# EAGLE design GE864 Breakout v12 (EAGLE 5.04)
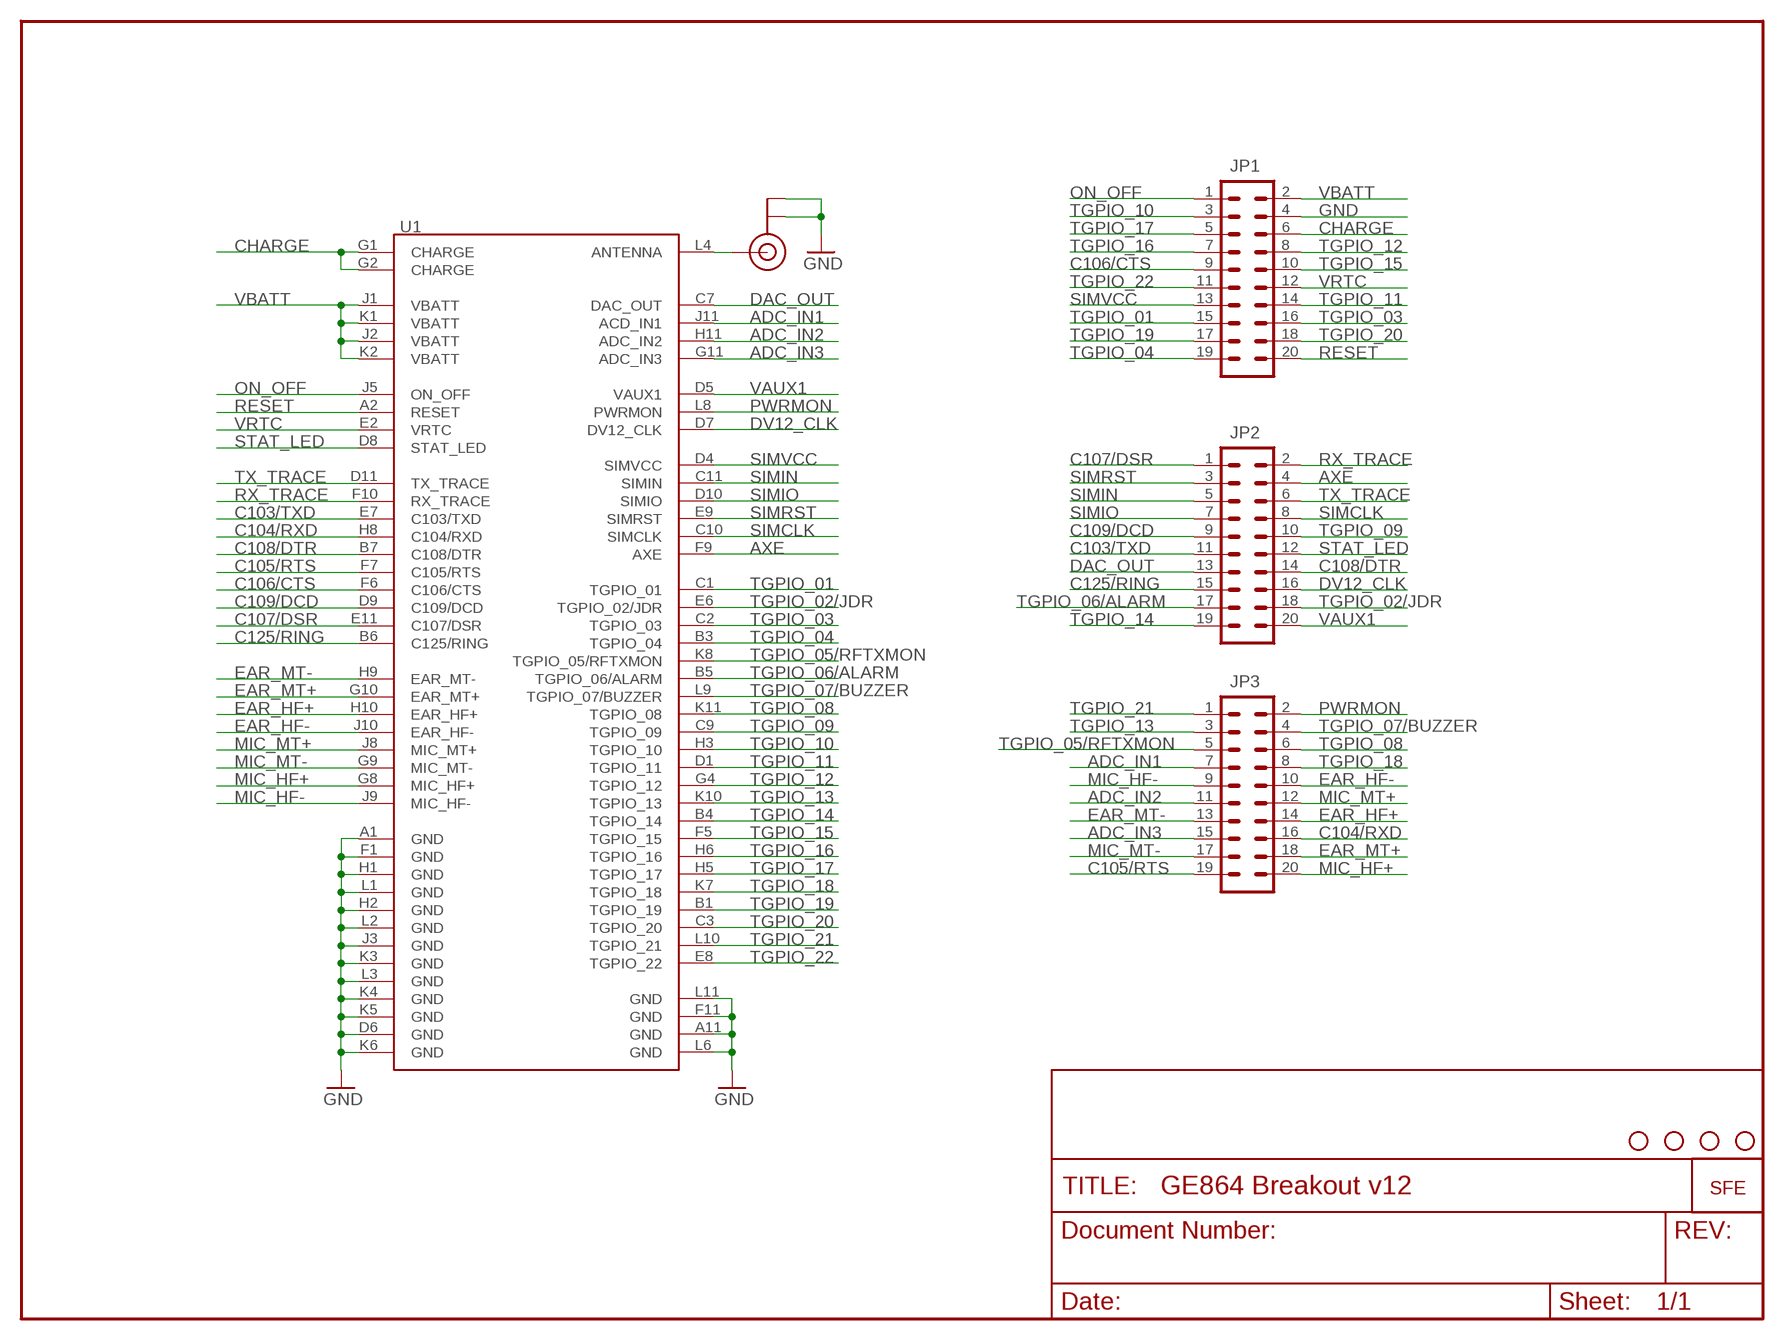
[diagram p0: schematic, sheet 1]

## Parts
JP1  M10X2NOSILK  [2X10_NOSILK]
JP2  M10X2NOSILK  [2X10_NOSILK]
JP3  M10X2NOSILK  [2X10_NOSILK]
U1  GE864  [GE864]
U$1  STAND-OFF  [STAND-OFF]
U$2  STAND-OFF  [STAND-OFF]
U$3  STAND-OFF  [STAND-OFF]
U$4  STAND-OFF  [STAND-OFF]
U$5  LOGO-SFENEW  [SFE-NEW-WEBLOGO]
U$6  U.FL  [U.FL]

## Nets
ADC_IN1: JP3.7 U1.J11(ACD_IN1)
ADC_IN2: JP3.11 U1.H11(ADC_IN2)
ADC_IN3: JP3.15 U1.G11(ADC_IN3)
AXE: JP2.4 U1.F9(AXE)
C103/TXD: JP2.11 U1.E7(C103/TXD)
C104/RXD: JP3.16 U1.H8(C104/RXD)
C105/RTS: JP3.19 U1.F7(C105/RTS)
C106/CTS: JP1.9 U1.F6(C106/CTS)
C107/DSR: JP2.1 U1.E11(C107/DSR)
C108/DTR: JP2.14 U1.B7(C108/DTR)
C109/DCD: JP2.9 U1.D9(C109/DCD)
C125/RING: JP2.15 U1.B6(C125/RING)
CHARGE: JP1.6 U1.G1(CHARGE) U1.G2(CHARGE)
DAC_OUT: JP2.13 U1.C7(DAC_OUT)
DV12_CLK: JP2.16 U1.D7(DV12_CLK)
EAR_HF+: JP3.14 U1.H10(EAR_HF+)
EAR_HF-: JP3.10 U1.J10(EAR_HF-)
EAR_MT+: JP3.18 U1.G10(EAR_MT+)
EAR_MT-: JP3.13 U1.H9(EAR_MT-)
GND: JP1.4 U1.A1(GND) U1.A11(GND) U1.D6(GND) U1.F1(GND) U1.F11(GND) U1.H1(GND) U1.H2(GND) U1.J3(GND) U1.K3(GND) U1.K4(GND) U1.K5(GND) U1.K6(GND) U1.L1(GND) U1.L2(GND) U1.L3(GND) U1.L6(GND) U1.L11(GND) U$6.P$1(GND) U$6.P$2(GND)
MIC_HF+: JP3.20 U1.G8(MIC_HF+)
MIC_HF-: JP3.9 U1.J9(MIC_HF-)
MIC_MT+: JP3.12 U1.J8(MIC_MT+)
MIC_MT-: JP3.17 U1.G9(MIC_MT-)
N$1: U1.L4(ANTENNA) U$6.P$3(SIGNAL)
ON_OFF: JP1.1 U1.J5(ON_OFF)
PWRMON: JP3.2 U1.L8(PWRMON)
RESET: JP1.20 U1.A2(RESET)
RX_TRACE: JP2.2 U1.F10(RX_TRACE)
SIMCLK: JP2.8 U1.C10(SIMCLK)
SIMIN: JP2.5 U1.C11(SIMIN)
SIMIO: JP2.7 U1.D10(SIMIO)
SIMRST: JP2.3 U1.E9(SIMRST)
SIMVCC: JP1.13 U1.D4(SIMVCC)
STAT_LED: JP2.12 U1.D8(STAT_LED)
TGPIO_01: JP1.15 U1.C1(TGPIO_01)
TGPIO_02/JDR: JP2.18 U1.E6(TGPIO_02/JDR)
TGPIO_03: JP1.16 U1.C2(TGPIO_03)
TGPIO_04: JP1.19 U1.B3(TGPIO_04)
TGPIO_05/RFTXMON: JP3.5 U1.K8(TGPIO_05/RFTXMON)
TGPIO_06/ALARM: JP2.17 U1.B5(TGPIO_06/ALARM)
TGPIO_07/BUZZER: JP3.4 U1.L9(TGPIO_07/BUZZER)
TGPIO_08: JP3.6 U1.K11(TGPIO_08)
TGPIO_09: JP2.10 U1.C9(TGPIO_09)
TGPIO_10: JP1.3 U1.H3(TGPIO_10)
TGPIO_11: JP1.14 U1.D1(TGPIO_11)
TGPIO_12: JP1.8 U1.G4(TGPIO_12)
TGPIO_13: JP3.3 U1.K10(TGPIO_13)
TGPIO_14: JP2.19 U1.B4(TGPIO_14)
TGPIO_15: JP1.10 U1.F5(TGPIO_15)
TGPIO_16: JP1.7 U1.H6(TGPIO_16)
TGPIO_17: JP1.5 U1.H5(TGPIO_17)
TGPIO_18: JP3.8 U1.K7(TGPIO_18)
TGPIO_19: JP1.17 U1.B1(TGPIO_19)
TGPIO_20: JP1.18 U1.C3(TGPIO_20)
TGPIO_21: JP3.1 U1.L10(TGPIO_21)
TGPIO_22: JP1.11 U1.E8(TGPIO_22)
TX_TRACE: JP2.6 U1.D11(TX_TRACE)
VAUX1: JP2.20 U1.D5(VAUX1)
VBATT: JP1.2 U1.J1(VBATT) U1.J2(VBATT) U1.K1(VBATT) U1.K2(VBATT)
VRTC: JP1.12 U1.E2(VRTC)

## Library data of the parts
JP1-JP3 = SparkFun:M10X2: This was SPECIALLY designed to be used with our Graphic LCD Backpack. Be sure you want to use this! It is not only staggered on each line of header holes, but IT IS ALSO offset of the center point of the top and bottom lines by 5 mil. This causes the headers to lock into place on the "standard" footprint on the LCD screen. The extra squares on the tdocu layer are there simply to reference other pins (if you were to actually populate a longer header than ten long - this is what we do with the backpacks).
U1 = SparkFun:GE864
U$1-U$4 = SparkFun:STAND-OFF: Stand Off This is the mechanical footprint for a #4 phillips button head screw. Use the keepout ring to avoid running the screw head into surrounding components. SKU : PRT-00447
U$5 = SparkFun:LOGO-SFE: Spark Fun Electronics PCB Logo This is the standard Spark Fun Electronics PCB logo.
U$6 = SparkFun:U.FL

## Board
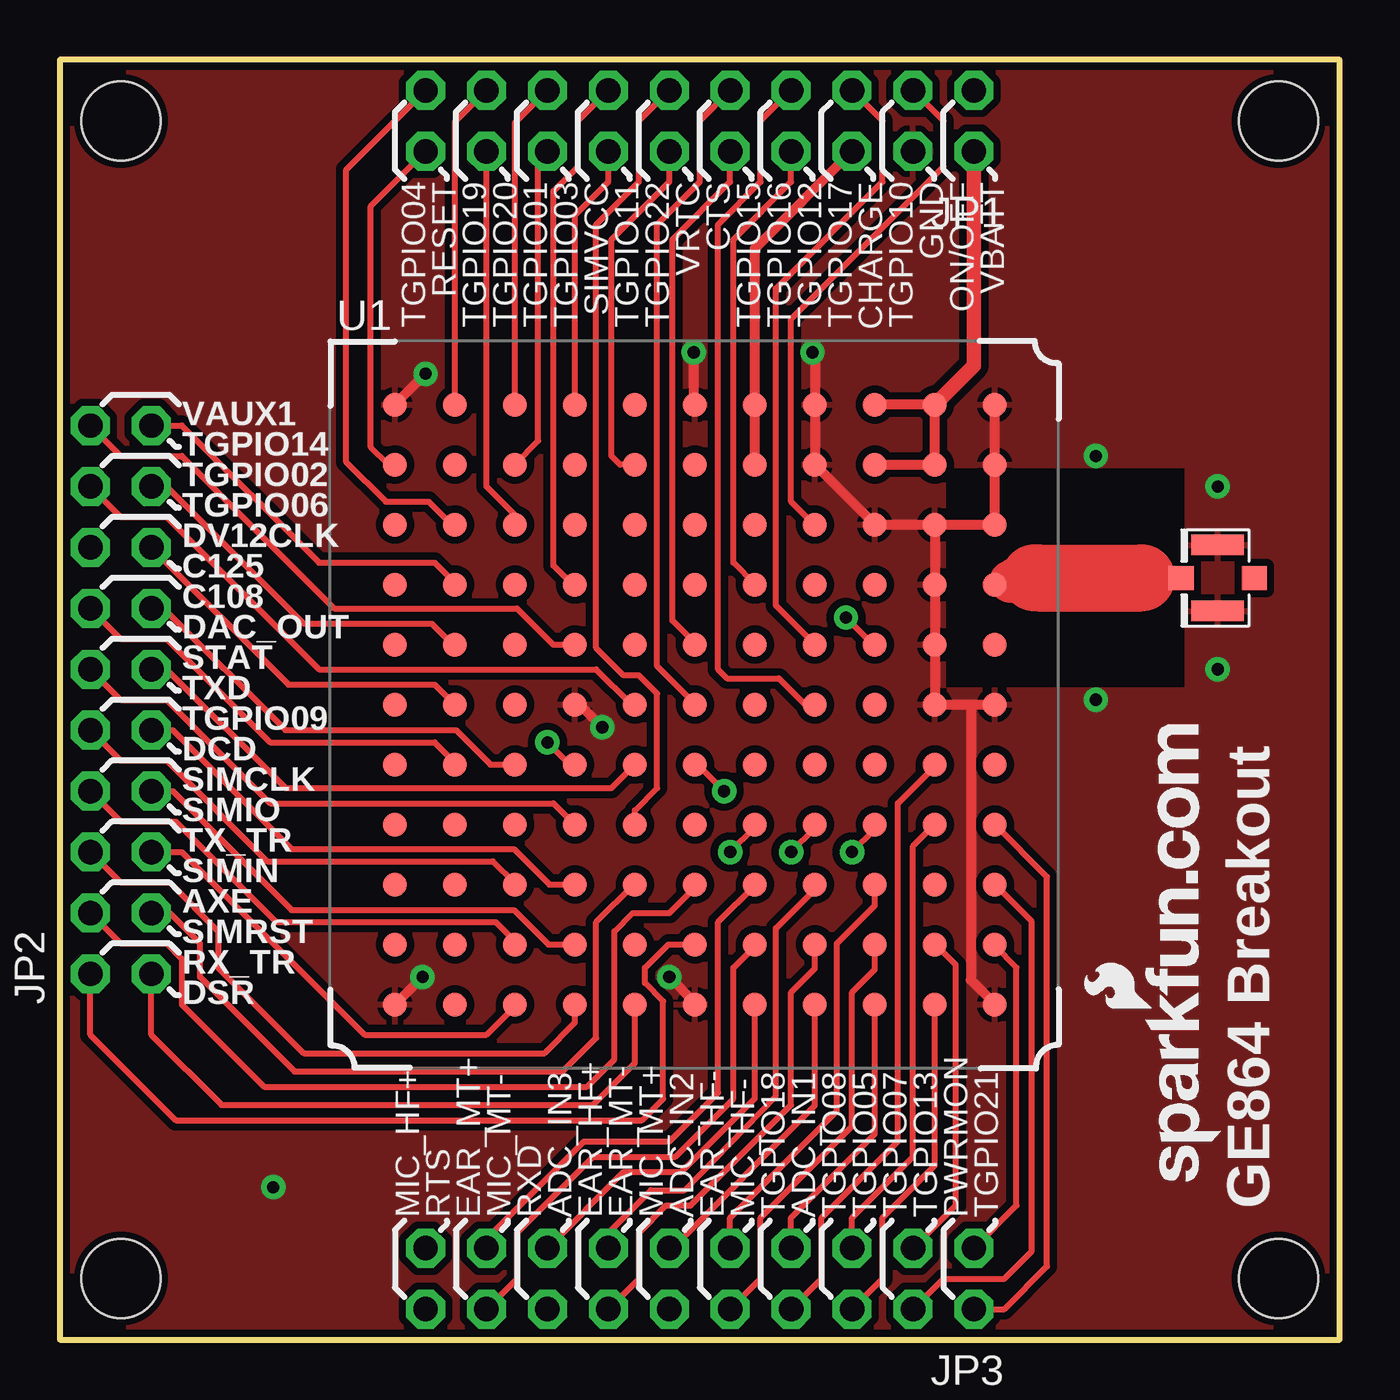
[diagram p1: board, top side]
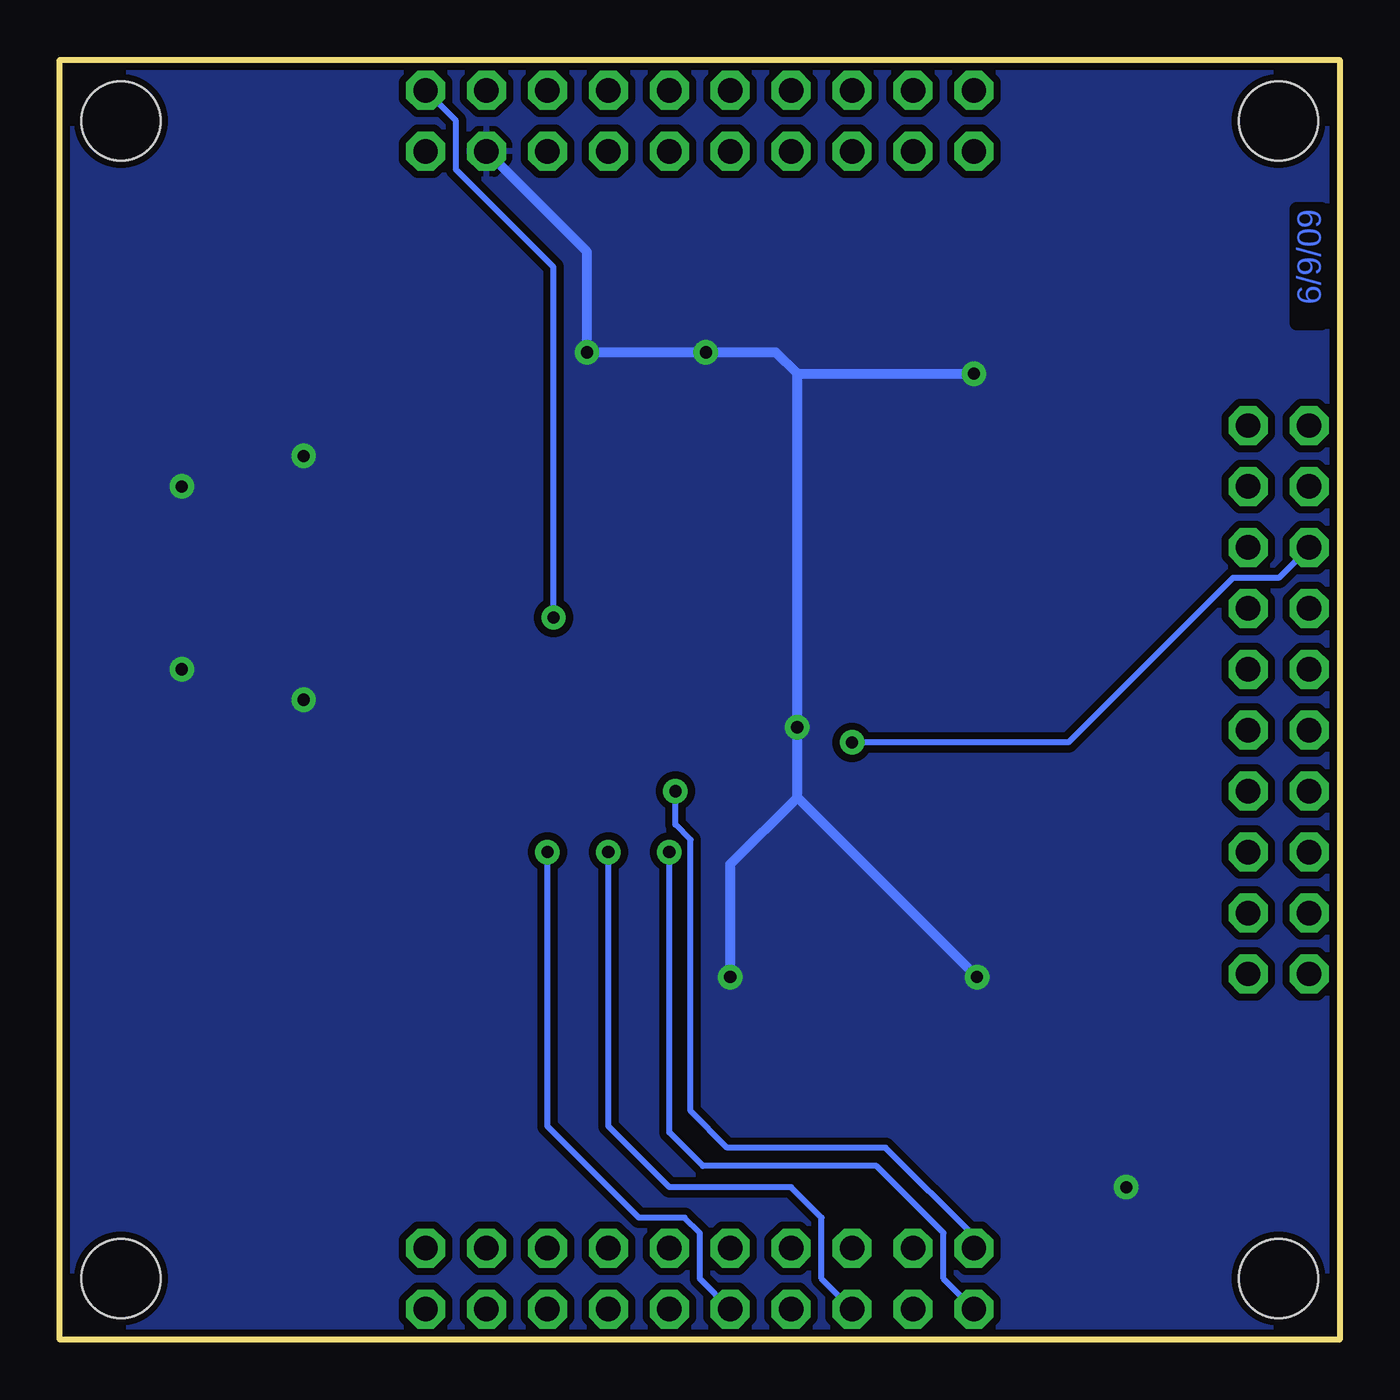
[diagram p2: board, bottom side, seen from below]

Size 53.34 x 53.34 mm. Coordinates in mm from the lower left corner, seen from the top.
Outline: 0,0 53.34,0 53.34,53.34 0,53.34 0,0
Copper layers (1*16): Top 0.035mm / dielectric 1.5mm / Bottom 0.035mm
Design rules "SparkFun": minimum track width 8mil, minimum drill 20mil, track to track 8mil, track to pad 8mil, pad to pad 8mil, via to via 8mil, smd to smd 8mil, copper to edge 10mil, drill to drill 8mil, minimum pad ring 12mil, minimum via ring 10mil, stop-mask expansion 4mil, vias tented up to drill 25mil, thermal gap 10mil

### Footprints (pad centres in the part's own frame; a part is rotated, then mirrored left to right if it is on the bottom)
2X10_NOSILK = drill 1.016 octagon: 1 -11.43,-1.27; 2 -11.43,1.27; 3 -8.89,-1.27; 4 -8.89,1.27; 5 -6.35,-1.27; 6 -6.35,1.27; 7 -3.81,-1.27; 8 -3.81,1.27; 9 -1.27,-1.27; 10 -1.27,1.27; 11 1.27,-1.27; 12 1.27,1.27; 13 3.81,-1.27; 14 3.81,1.27; 15 6.35,-1.27; 16 6.35,1.27; 17 8.89,-1.27; 18 8.89,1.27; 19 11.43,-1.27; 20 11.43,1.27
GE864 = smd 1 x 1: A1 0,25; A2 0,22.5; A3 0,20; A4 0,17.5; A5 0,15; A6 0,12.5; A7 0,10; A8 0,7.5; A9 0,5; A10 0,2.5; A11 0,0; B1 2.5,25; B2 2.5,22.5; B3 2.5,20; B4 2.5,17.5; B5 2.5,15; B6 2.5,12.5; B7 2.5,10; B8 2.5,7.5; B9 2.5,5; B10 2.5,2.5; B11 2.5,0; C1 5,25; C2 5,22.5; C3 5,20; C4 5,17.5; C5 5,15; C6 5,12.5; C7 5,10; C8 5,7.5; C9 5,5; C10 5,2.5; C11 5,0; D1 7.5,25; D2 7.5,22.5; D3 7.5,20; D4 7.5,17.5; D5 7.5,15; D6 7.5,12.5; D7 7.5,10; D8 7.5,7.5; D9 7.5,5; D10 7.5,2.5; D11 7.5,0; E1 10,25; E2 10,22.5; E3 10,20; E4 10,17.5; E5 10,15; E6 10,12.5; E7 10,10; E8 10,7.5; E9 10,5; E10 10,2.5; E11 10,0; F1 12.5,25; F2 12.5,22.5; F3 12.5,20; F4 12.5,17.5; F5 12.5,15; F6 12.5,12.5; F7 12.5,10; F8 12.5,7.5; F9 12.5,5; F10 12.5,2.5; F11 12.5,0; G1 15,25; G2 15,22.5; G3 15,20; G4 15,17.5; G5 15,15; G6 15,12.5; G7 15,10; G8 15,7.5; G9 15,5; G10 15,2.5; G11 15,0; H1 17.5,25; H2 17.5,22.5; H3 17.5,20; H4 17.5,17.5; H5 17.5,15; H6 17.5,12.5; H7 17.5,10; H8 17.5,7.5; H9 17.5,5; H10 17.5,2.5; H11 17.5,0; J1 20,25; J2 20,22.5; J3 20,20; J4 20,17.5; J5 20,15; J6 20,12.5; J7 20,10; J8 20,7.5; J9 20,5; J10 20,2.5; J11 20,0; K1 22.5,25; K2 22.5,22.5; K3 22.5,20; K4 22.5,17.5; K5 22.5,15; K6 22.5,12.5; K7 22.5,10; K8 22.5,7.5; K9 22.5,5; K10 22.5,2.5; K11 22.5,0; L1 25,25; L2 25,22.5; L3 25,20; L4 25,17.5; L5 25,15; L6 25,12.5; L7 25,10; L8 25,7.5; L9 25,5; L10 25,2.5; L11 25,0
STAND-OFF = hole 3.302: 0,0
U.FL = smd 2.2 x 0.85: P$1 0,1.375; P$2 0,-1.375 | smd 1.05 x 1: P$3 1.525,0; P$4 -1.525,0

### Placement (x,y rotation side)
JP1  26.67,50.8 180 top
JP2  2.54,26.67 90 top
JP3  26.67,2.54 180 top
U1  13.97,13.97 0 top
U$1  50.8,2.54 0 top
U$2  2.54,50.8 0 top
U$3  50.8,50.8 0 top
U$4  2.54,2.54 0 top
U$5  48.39,6.6 90 top
U$6  48.26,31.75 180 top

### Tracks (layer width: path | path; a pad name or v marks a point on that pad's centre or on a via)
ADC_IN1
  Top 0.254: U1.J11 33.97,8.57 30.48,5.08 JP3.7
ADC_IN2
  Top 0.254: U1.H11 31.47,9.75 25.53,3.81 JP3.11
ADC_IN3
  Top 0.254: U1.G11 28.97,10.05 25.91,6.99 23.5,6.99 JP3.15
AXE
  Top 0.254: U1.F9 26.47,18.85 25.4,17.78 23.88,17.78 23.11,17.02 23.11,11.68 21.97,10.54 8.51,10.54 5.08,13.97 5.08,15.88 4.45,16.51 2.54,16.51 JP2.4
C103/TXD
  Top 0.254: U1.E7 22.99,22.99 9.4,22.99 4.45,27.94 JP2.11
C104/RXD  (via drill 0.51)
  Top 0.254: U1.H8 31.47,21.31 v30.48,20.32
  Bottom 0.254: v30.48,20.32 30.48,8.89 27.94,6.35 22.86,6.35 21.59,5.08 21.59,2.54 JP3.16
C105/RTS  (via drill 0.51)
  Top 0.254: U1.F7 26.58,23.97 v27.69,22.86
  Bottom 0.254: v27.69,22.86 27.69,21.46 27.05,20.83 27.05,9.53 25.53,8 18.92,8 15.24,4.32 JP3.19
C106/CTS
  Top 0.254: U1.F6 26.47,26.49 24.89,28.07 24.89,46.48 26.67,48.26 26.67,50.8 JP1.9
C107/DSR
  Top 0.254: U1.E11 23.97,11.52 22.23,9.78 6.73,9.78 3.81,12.7 JP2.1
C108/DTR
  Top 0.254: U1.B7 16.47,24.04 15.62,24.89 8.76,24.89 4.45,29.21 2.54,29.21 JP2.14
C109/DCD
  Top 0.254: U1.D9 20.4,18.97 18.92,20.45 9.65,20.45 4.7,25.4 JP2.9
C125/RING
  Top 0.254: U1.B6 16.46,26.47 15.62,27.3 9.53,27.3 JP2.15
CHARGE
  Top 0.406: U1.G2 U1.G1 28.97,45.48 JP1.6
DAC_OUT
  Top 0.254: U1.C7 17.94,23.97 16.51,25.4 9.4,25.4 4.32,30.48 JP2.13
DV12_CLK  (via drill 0.51)
  Top 0.254: U1.D7 21.24,23.97 v20.32,24.89
  Bottom 0.254: v20.32,24.89 11.3,24.89 4.45,31.75 2.54,31.75 JP2.16
EAR_HF+
  Top 0.254: U1.H10 31.47,15.47 30.48,14.48 30.48,9.78 26.29,5.59 25.27,5.59 24.13,4.45 24.13,2.54 JP3.14
EAR_HF-
  Top 0.254: U1.J10 33.97,15.43 33.02,14.48 33.02,8.89 29.21,5.08 29.21,2.54 JP3.10
EAR_MT+
  Top 0.254: U1.G10 28.97,16.4 28.07,15.49 28.07,10.03 25.65,7.62 22.23,7.62 19.05,4.45 19.05,2.54 JP3.18
EAR_MT-
  Top 0.254: U1.H9 31.47,18.77 29.84,17.14 29.84,10.16 26.04,6.22 24.64,6.22 22.86,4.45 JP3.13
GND  (via drill 0.51)
  Top 0.406: U1.L1 U1.L2 U1.L3 U1.K3 | U1.K3 U1.J3 U1.H2 U1.H1 31.47,41.05 v31.37,41.15 | U1.K3 U1.K4 U1.K5 U1.K6 37.85,26.47 | 37.85,26.47 U1.L6 | U1.L11 38.97,13.99 37.97,14.99 37.97,26.34 37.85,26.47 | 26.45,38.99 U1.F1 26.42,39.02 v26.42,41.15 | U1.A1 13.97,38.99 v15.24,40.26 | U1.D6 21.66,26.47 v22.61,25.53 | U1.A11 v15.11,15.11 | U1.F11 26.47,14.04 v25.4,15.11
  Bottom 0.406: v15.24,40.26 22.48,40.26 22.61,40.13 | 22.61,40.13 v22.61,25.53 22.61,22.61 | v15.11,15.11 22.61,22.61 | v25.4,15.11 25.4,19.81 22.61,22.61 | 22.61,40.13 22.61,40.26 23.5,41.15 v26.42,41.15 v31.37,41.15 31.37,45.34 JP1.4
  other vias: 43.18,36.83 43.18,26.67 8.89,6.35 48.26,35.56 48.26,27.94
  pour Bottom (isolate 0.305): 0,0 53.34,0 53.34,53.34 0,53.34
  pour Top (isolate 0.305): 0,0 53.34,0 53.34,27.05 36.83,27.05 36.83,36.45 53.34,36.45 53.34,53.34 0,53.34
  pour Top (isolate 0.305): 53.34,36.83 46.99,36.83 46.99,26.67 53.34,26.67
MIC_HF+  (via drill 0.51)
  Top 0.254: U1.G8 28.97,21.35 v27.94,20.32
  Bottom 0.254: v27.94,20.32 27.94,8.64 26.54,7.24 19.3,7.24 16.51,4.45 16.51,2.54 JP3.20
MIC_HF-
  Top 0.254: U1.J9 33.97,18.09 32.38,16.51 32.38,9.53 27.94,5.08 JP3.9
MIC_MT+  (via drill 0.51)
  Top 0.254: U1.J8 33.97,21.27 v33.02,20.32
  Bottom 0.254: v33.02,20.32 33.02,8.89 29.21,5.08 27.3,5.08 26.67,4.45 26.67,2.54 JP3.12
MIC_MT-
  Top 0.254: U1.G9 28.97,18.94 27.43,17.4 27.43,10.29 25.4,8.26 21.84,8.26 17.78,4.19 JP3.17
N$1
  Top 0.254: U1.L4 39.62,31.47 39.62,31.6 | 45.09,31.75 U$6.P$3
  Top 1.27: 40.77,31.47 40.77,31.75
  Top 1.778: 40.77,31.47 39.62,31.6 39.88,31.75
  Top 2.794: 40.64,31.75 40.77,31.75 45.09,31.75
ON_OFF  (via drill 0.51)
  Top 0.254: U1.J5 33.9,28.97 v32.77,30.1
  Bottom 0.254: v32.77,30.1 32.77,44.7 36.83,48.77 36.83,50.8 JP1.1
PWRMON
  Top 0.254: U1.L8 41.15,19.29 41.15,3.05 39.37,1.27 JP3.2
RESET
  Top 0.254: U1.A2 13.7,36.47 12.95,37.21 12.95,47.24 JP1.20
RX_TRACE
  Top 0.254: U1.F10 25.36,16.47 24.38,15.49 24.38,14.86 25.15,14.1 25.15,10.03 24.26,9.14 4.83,9.14 1.27,12.7 JP2.2
SIMCLK
  Top 0.254: U1.C10 18.97,16.59 18.16,17.4 9.02,17.4 4.83,21.59 2.54,21.59 JP2.8
SIMIN
  Top 0.254: U1.C11 18.97,13.89 17.78,12.7 12.7,12.7 5.08,20.32 JP2.5
SIMIO
  Top 0.254: U1.D10 20.36,16.47 18.92,17.91 9.65,17.91 4.7,22.86 JP2.7
SIMRST
  Top 0.254: U1.E9 23.92,18.97 22.35,17.4 22.35,12.57 20.95,11.18 9.78,11.18 5.84,15.11 5.84,16.51 4.57,17.78 JP2.3
SIMVCC
  Top 0.254: U1.D4 21.36,31.47 20.57,32.26 20.57,47.88 21.59,48.9 21.59,50.8 JP1.13
STAT_LED
  Top 0.254: U1.D8 21.46,21.47 20.57,22.35 8.76,22.35 4.45,26.67 2.54,26.67 JP2.12
TGPIO_01
  Top 0.254: U1.C1 18.97,50.72 JP1.15
TGPIO_02/JDR
  Top 0.254: U1.E6 23.82,26.47 22.35,27.94 10.79,27.94 4.45,34.29 2.54,34.29 JP2.18
TGPIO_03
  Top 0.254: U1.C2 18.97,36.5 19.94,37.47 19.94,49.15 JP1.16
TGPIO_04
  Top 0.254: U1.B3 16.32,33.97 15.37,34.92 13.59,34.92 11.94,36.58 11.94,48.77 JP1.19
TGPIO_05/RFTXMON
  Top 0.254: U1.K8 36.46,21.47 35.56,20.57 35.56,7.62 33.02,5.08 JP3.5
TGPIO_06/ALARM
  Top 0.254: U1.B5 16.37,28.97 15.49,29.84 10.16,29.84 4.45,35.56 JP2.17
TGPIO_07/BUZZER
  Top 0.254: U1.L9 40.51,17.43 40.51,3.68 39.37,2.54 36.83,2.54 JP3.4
TGPIO_08
  Top 0.254: U1.K11 36.47,7.26 34.29,5.08 34.29,2.54 JP3.6
TGPIO_09
  Top 0.254: U1.C9 18.97,19 18.03,19.94 8.64,19.94 4.45,24.13 2.54,24.13 JP2.10
TGPIO_10
  Top 0.254: U1.H3 31.43,33.97 30.48,34.92 30.48,42.55 36.83,48.9 36.83,50.8 JP1.3
TGPIO_11
  Top 0.254: U1.D1 21.47,46.87 22.86,48.26 JP1.14
TGPIO_12
  Top 0.254: U1.G4 28.97,31.48 28.07,32.38 28.07,45.85 30.48,48.26 JP1.8
TGPIO_13
  Top 0.254: U1.K10 36.49,16.47 37.34,15.62 37.34,5.59 JP3.3
TGPIO_14
  Top 0.254: U1.B4 16.47,31.54 15.62,32.38 10.79,32.38 5.08,38.1 JP2.19
TGPIO_15
  Top 0.254: U1.F5 26.47,29.03 25.53,29.97 25.53,45.85 27.94,48.26 JP1.10
TGPIO_16
  Top 0.254: U1.H6 31.06,26.47 29.97,27.56 27.81,27.56 27.43,27.94 27.43,46.48 29.21,48.26 29.21,50.8 JP1.7
TGPIO_17
  Top 0.254: U1.H5 31.47,28.98 29.84,30.61 29.84,43.81 34.29,48.26 34.29,50.8 JP1.5
TGPIO_18
  Top 0.254: U1.K7 36.47,23.9 34.92,22.35 34.92,8.26 31.75,5.08 31.75,2.54 JP3.8
TGPIO_19
  Top 0.254: U1.B1 16.47,50.76 JP1.17
TGPIO_20
  Top 0.254: U1.C3 18.97,34.37 17.78,35.56 JP1.18
TGPIO_21
  Top 0.254: U1.L10 38.97,16.4 39.88,15.49 39.88,5.59 JP3.1
TGPIO_22
  Top 0.254: U1.E8 23.97,22.07 24.89,22.99 24.89,26.92 24.13,27.69 23.5,27.69 22.35,28.83 22.35,46.48 24.13,48.26 24.13,50.8 JP1.11
TX_TRACE
  Top 0.254: U1.D11 21.47,13.21 20.19,11.94 10.16,11.94 6.6,15.49 6.6,17.02 4.57,19.05 2.54,19.05 JP2.6
VAUX1
  Top 0.254: U1.D5 20.56,28.97 19.05,30.48 11.43,30.48 5.08,36.83 2.54,36.83 JP2.20
VBATT
  Top 0.406: U1.J1 U1.K1 36.47,36.83 | 36.47,36.83 U1.K2 | U1.J2 36.11,36.47 36.47,36.83
  Top 0.61: JP1.2 38.1,40.6 U1.K1
VRTC
  Top 0.254: U1.E2 23.35,36.47 22.99,36.83 22.99,45.85 25.4,48.26 JP1.12

### Text on the board
Bottom: 6/9/09
tPlace: TGPIO04 | RESET | TGPIO19 | TGPIO20 | TGPIO01 | TGPIO03 | SIMVCC | TGPIO11 | TGPIO22 | VRTC | CTS | TGPIO15 | TGPIO16 | TGPIO12 | TGPIO17 | CHARGE | TGPIO10 | GND | ON/OFF | VBATT | VAUX1 | TGPIO14 | TGPIO02 | TGPIO06 | DV12CLK | C125 | C108 | DAC_OUT | STAT | TXD | TGPIO09 | DCD | SIMCLK | SIMIO | TX_TR | SIMIN | AXE | SIMRST | RX_TR | DSR | MIC_HF+ | RTS | EAR_MT+ | MIC_MT- | RXD | ADC_IN3 | EAR_HF+ | EAR_MT- | MIC_MT+ | ADC_IN2 | EAR_HF- | MIC_HF- | TGPIO18 | ADC_IN1 | TGPIO08 | TGPIO05 | TGPIO07 | TGPIO13 | PWRMON | TGPIO21 | GE864 Breakout